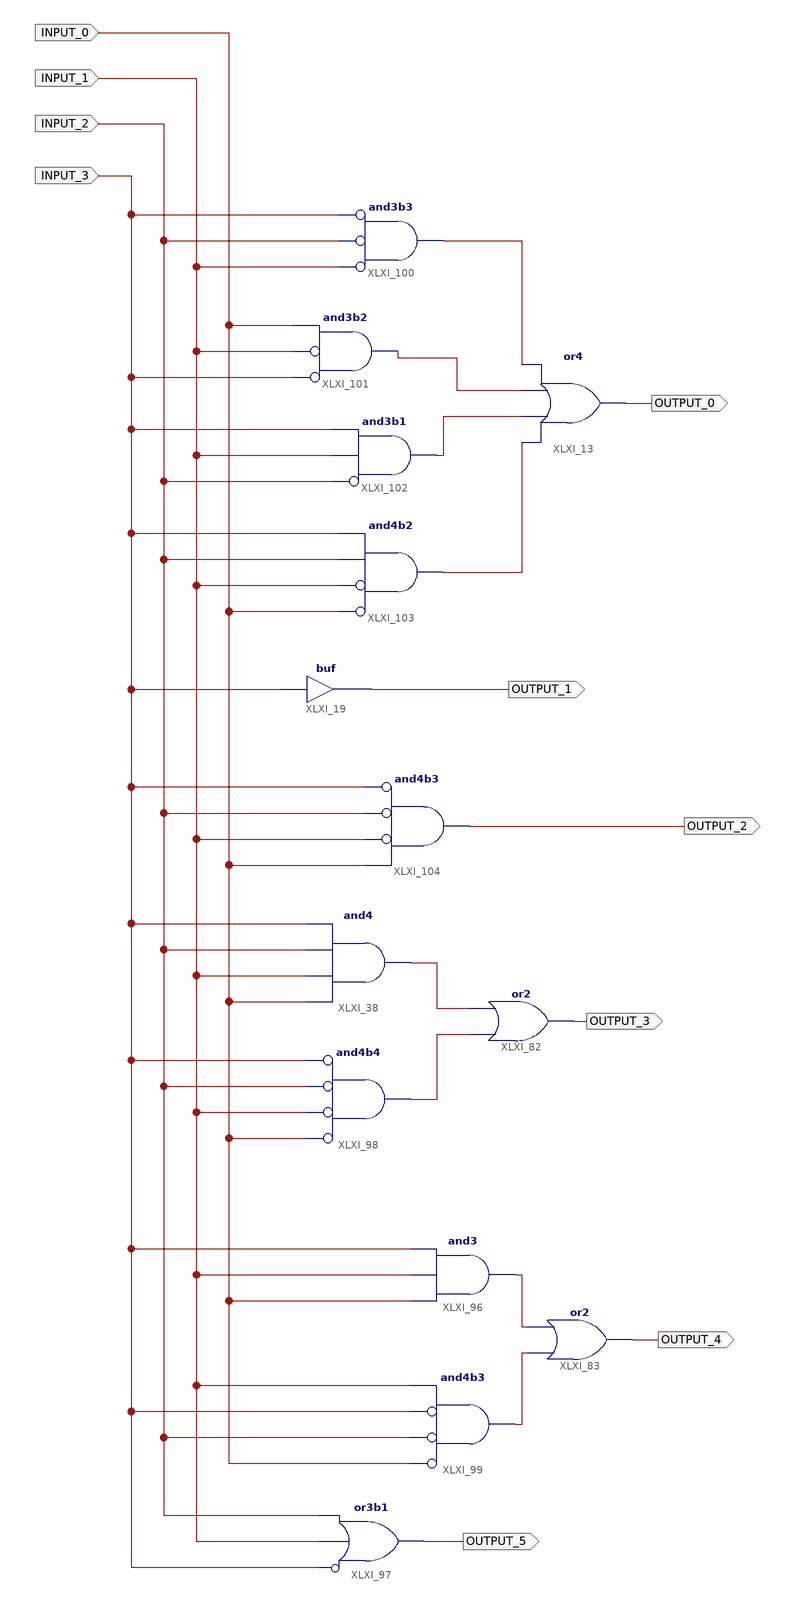
[diagram p0: schematic sheet 1]
// Xilinx ISE schematic schemelab.sch (spartan3a) as structural Verilog: 14 symbols, 10 ports
module schemelab (
  input  INPUT_0,
  input  INPUT_1,
  input  INPUT_2,
  input  INPUT_3,
  output OUTPUT_1,
  output OUTPUT_3,
  output OUTPUT_5,
  output OUTPUT_4,
  output OUTPUT_2,
  output OUTPUT_0
);

  wire XLXN_10, XLXN_13, XLXN_29, XLXN_33, XLXN_164, XLXN_166, XLXN_191, XLXN_195;

  buf XLXI_19 (OUTPUT_1, INPUT_3);
  and XLXI_38 (XLXN_195, INPUT_0, INPUT_1, INPUT_2, INPUT_3);
  or XLXI_82 (OUTPUT_3, XLXN_164, XLXN_195);
  and XLXI_98 (XLXN_164, ~INPUT_0, ~INPUT_1, ~INPUT_2, ~INPUT_3);  // and4b4
  and XLXI_99 (XLXN_166, ~INPUT_0, ~INPUT_2, ~INPUT_3, INPUT_1);  // and4b3
  or XLXI_97 (OUTPUT_5, ~INPUT_3, INPUT_1, INPUT_2);  // or3b1
  and XLXI_96 (XLXN_191, INPUT_0, INPUT_1, INPUT_3);
  or XLXI_83 (OUTPUT_4, XLXN_166, XLXN_191);
  and XLXI_104 (OUTPUT_2, ~INPUT_3, ~INPUT_2, ~INPUT_1, INPUT_0);  // and4b3
  and XLXI_100 (XLXN_10, ~INPUT_1, ~INPUT_2, ~INPUT_3);  // and3b3
  and XLXI_101 (XLXN_33, ~INPUT_3, ~INPUT_1, INPUT_0);  // and3b2
  and XLXI_102 (XLXN_13, ~INPUT_2, INPUT_1, INPUT_3);  // and3b1
  and XLXI_103 (XLXN_29, ~INPUT_0, ~INPUT_1, INPUT_2, INPUT_3);  // and4b2
  or XLXI_13 (OUTPUT_0, XLXN_29, XLXN_13, XLXN_33, XLXN_10);
endmodule
